# Altium schematic sheet Main.SchDoc
size A4; SheetNumber: 1; SheetTotal: 1
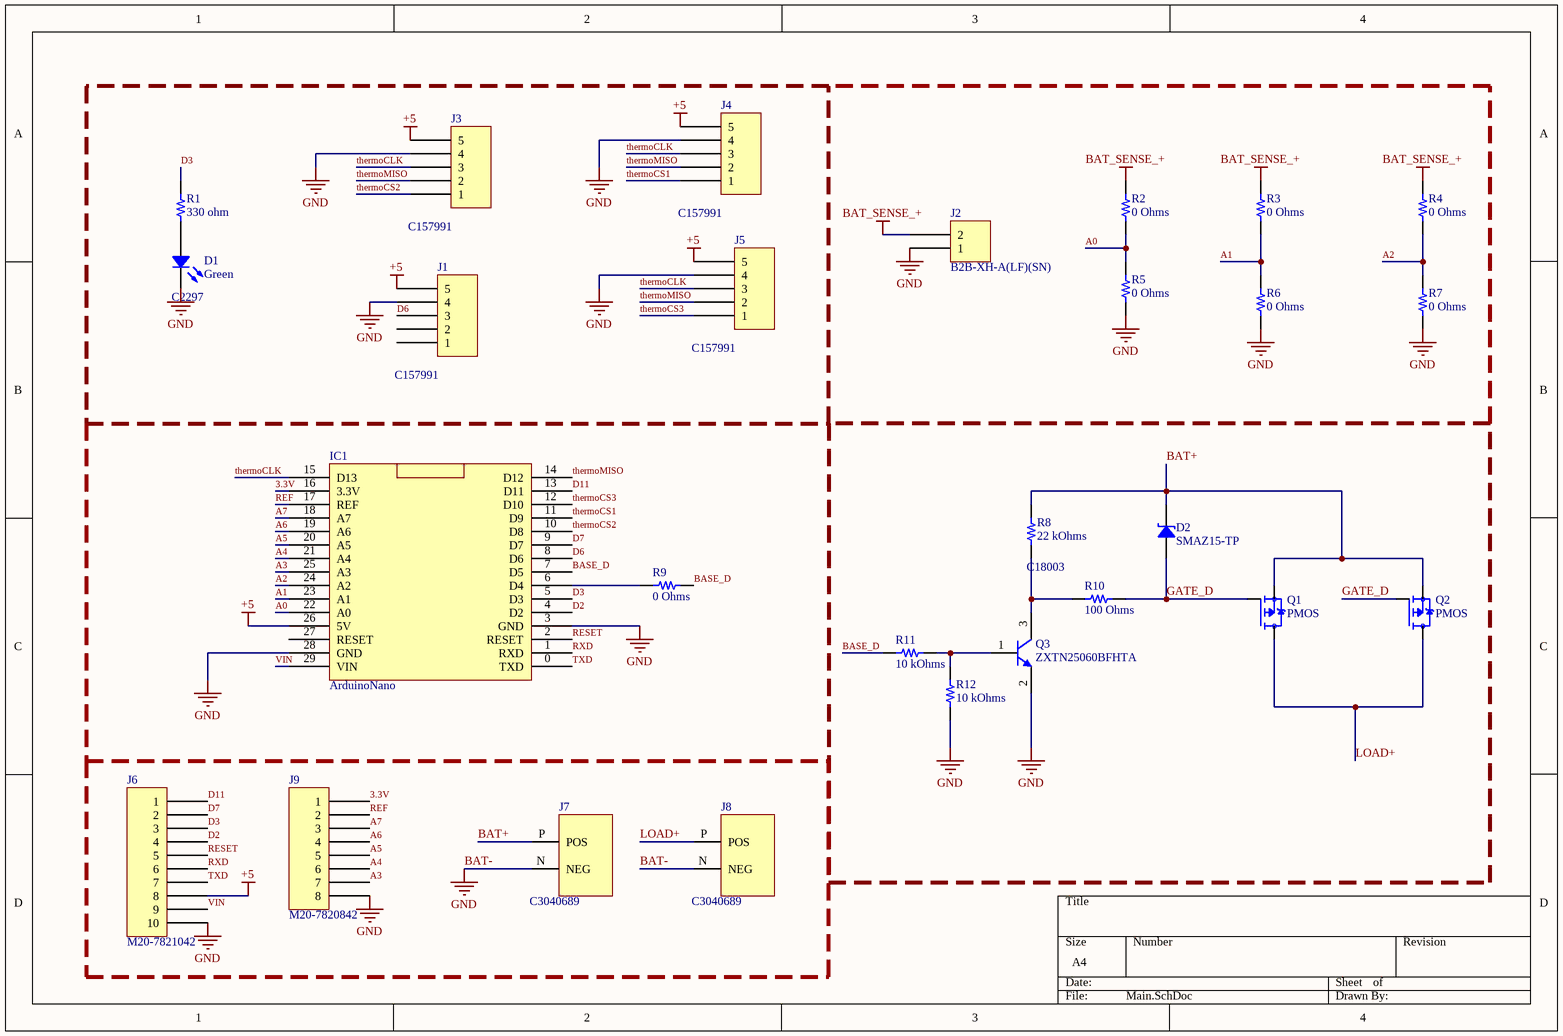
[diagram p0: Main.SchDoc]

## Parts
D1  Green  JLCPCB Part Number: C2297  [LED 0805_2012 GREEN]
D2  SMAZ15-TP  [DO214AC SMA]
IC1  ArduinoNano  [ArduinoNano_3D]
J1  JLCPCB Part Number: C157991  [JST XH B5B-XH-A]  (hidden comment: B5B-XH-A(LF)(SN))
J2  B2B-XH-A(LF)(SN)  [JST XH B2B-XH-A]
J3  JLCPCB Part Number: C157991  [JST XH B5B-XH-A]  (hidden comment: B5B-XH-A(LF)(SN))
J4  JLCPCB Part Number: C157991  [JST XH B5B-XH-A]  (hidden comment: B5B-XH-A(LF)(SN))
J5  JLCPCB Part Number: C157991  [JST XH B5B-XH-A]  (hidden comment: B5B-XH-A(LF)(SN))
J6  M20-7821042  [HARWIN M20-7821045]
J7  JLCPCB Part Number: C3040689  [XT90_PW-M]  (hidden comment: SMT XT90 CONNECTOR)
J8  JLCPCB Part Number: C3040689  [XT90_PW-M]  (hidden comment: SMT XT90 CONNECTOR)
J9  M20-7820842  [HARWIN M20-7820845]
Q1  PMOS  [TO-263-3-2]
Q2  PMOS  [TO-263-3-2]
Q3  ZXTN25060BFHTA  [DIODES SOT-23-3]
R1  330 ohm  [RES 1206_3216]
R2  0 Ohms  [RES 1206_3216]
R3  0 Ohms  [RES 1206_3216]
R4  0 Ohms  [RES 1206_3216]
R5  0 Ohms  [RES 1206_3216]
R6  0 Ohms  [RES 1206_3216]
R7  0 Ohms  [RES 1206_3216]
R8  22 kOhms  JLCPCB Part Number: C18003  [RES 1206_3216]
R9  0 Ohms  [YAGEO RES RK73 RS73 SG73 0805_2012]
R10  100 Ohms  [RES 1206_3216]
R11  10 kOhms  [RES 1206_3216]
R12  10 kOhms  [RES 1206_3216]

## Nets
+5: IC1.26(5V) J1.5 J3.5 J4.5 J5.5 J6.8
BAT-: D1.2 IC1.3(GND) IC1.28(GND) J1.4 J2.1 J3.4 J4.4 J5.4 J6.10 J7.N(NEG) J8.N(NEG) J9.8 Q3.2(E) R5.1 R6.1 R7.1 R12.1  [also labelled GND]
BAT_SENSE_+: J2.2 R2.2 R3.2 R4.2
3.3V: IC1.16(3.3V) J9.1
A0: IC1.22(A0) R2.1 R5.2
A1: IC1.23(A1) R3.1 R6.2
A2: IC1.24(A2) R4.1 R7.2
A3: IC1.25(A3) J9.7
A4: IC1.21(A4) J9.6
A5: IC1.20(A5) J9.5
A6: IC1.19(A6) J9.4
A7: IC1.18(A7) J9.3
BASE_D: IC1.7(D5) R9.1 R11.1
BAT+: D2.2 J7.P(POS) Q1.2(S) Q2.2(S) R8.2
D2: IC1.4(D2) J6.4
D3: IC1.5(D3) J6.3 R1.2
D6: IC1.8(D6) J1.3
D7: IC1.9(D7) J6.2
D11: IC1.13(D11) J6.1
GATE_D: D2.1 Q1.1(G) Q2.1(G) R10.2
LOAD+: J8.P(POS) Q1.3(D) Q2.3(D)
REF: IC1.17(REF) J9.2
RESET: IC1.2(RESET) J6.5
RXD: IC1.1(RXD) J6.6
thermoCLK: IC1.15(D13) J3.3 J4.3 J5.3
thermoCS1: IC1.11(D9) J4.1
thermoCS2: IC1.10(D8) J3.1
thermoCS3: IC1.12(D10) J5.1
thermoMISO: IC1.14(D12) J3.2 J4.2 J5.2
TXD: IC1.0(TXD) J6.7
VIN: IC1.29(VIN) J6.9
NetD1_1: D1.1 R1.1
NetIC1_6: IC1.6(D4) R9.2
NetQ3_1: Q3.1(B) R11.2 R12.2
NetQ3_3: Q3.3(C) R8.1 R10.1

Not connected (* = marked no-connect by the designer): IC1 27(RESET); J1 1 2

## Library data of the parts
D1 = 597-5311-407NF: LED GREEN DIFFUSED 0805 SMD; Manufacturer: Dialight; Current - Test: 20mA; Lens Color: White; Lens Size: 1.30mm x 1.25mm; Lens Style: Rectangle with Flat Top; Millicandela Rating: 16mcd; Viewing Angle: 140°; Voltage - Forward (Vf) (Typ): 2.15V; Wavelength - Dominant: 562nm; Part Number: 597-5311-407NF; Color: Green; ComponentLink1Description: Datasheet; ComponentLink1URL: https://s3-us-west-2.amazonaws.com/catsy.557/C18701.pdf; ComponentLink2Description: DigiKey Link; ComponentLink2URL: https://www.digikey.com/en/products/detail/dialight/597-5311-407NF/21710538; Device Package: 0805 (2012 Metric); Height (Max): 0.93mm; LastUpdated: 3.06.2024 20:00:23; Lens Transparency: Diffused; Lifecycle Status: Active; Minimum Order: 1; Mounting Type: Surface Mount; Package / Case: 0805 (2012 Metric); Packaging: TapeAndReel; PartId: 1475; Price: 0.08; Series: 597; Size / Dimension: 2.00mm L x 1.25mm W; Supplier 1: DigiKey; Supplier Part Number 1: 350-597-5311-407NFCT-ND; Supplier Device Package: 0805; Value: Green
D2 = SMAZ15-TP: DIODE ZENER 15V 1W DO214AC; Manufacturer: Micro Commercial Co; Current - Reverse Leakage @ Vr: 1 µA @ 11.4 V; Impedance (Max) (Zzt): 10 Ohms; Tolerance: ±5%; Voltage - Forward (Vf) (Max) @ If: 1.2 V @ 200 mA; Part Number: SMAZ15-TP; ComponentLink1Description: Datasheet; ComponentLink1URL: https://www.mccsemi.com/pdf/Products/SMAZ5V1%20-%20SMAZ39(DO-214AC).pdf; ComponentLink2Description: DigiKey Link; ComponentLink2URL: https://www.digikey.com/en/products/detail/micro-commercial-co/SMAZ15-TP/1793256; LastUpdated: 3.06.2024 19:55:30; Lifecycle Status: Active; Minimum Order: 1; Mounting Type: Surface Mount; Operating Temperature: -65°C ~ 150°C; Package / Case: DO-214AC, SMA; Packaging: TapeAndReel; PartId: 1156; Part Status: Active; Power - Max: 1 W; Price: 0.05; Series: -; Supplier 1: DigiKey; Supplier Part Number 1: SMAZ15-TPMSCT-ND; Supplier Device Package: DO-214AC (SMAJ); Voltage - Zener (Nom) (Vz): 15 V; JLCPCB Part Number: C110524
IC1 = ArduinoNano: ArduinoNano 3D
J1 J3-J5 = B5B-XH-A(LF)(SN): CONN HEADER VERT 5POS 2.5MM; Manufacturer: JST Sales America Inc.; Contact Length - Post: 0.134" (3.40mm); Current Rating (Amps): 3A; Material Flammability Rating: UL94 V-0; Number of Positions: 5; Number of Positions Loaded: All; Pitch - Mating: 0.098" (2.50mm); Shrouding: Shrouded - 4 Wall; Style: Board to Cable/Wire; Voltage Rating: 250V; Part Number: B5B-XH-A(LF)(SN); ComponentLink1Description: Datasheet; ComponentLink1URL: http://www.jst-mfg.com/product/pdf/eng/eXH.pdf; ComponentLink2Description: DigiKey Link; ComponentLink2URL: http://digikey.com/product-detail/en/jst-sales-america-inc/B5B-XH-A-LF-SN/455-2270-ND/1530483; Connector Type: Header; Contact Finish - Mating: Tin; Contact Finish - Post: Tin; Contact Material: Brass; Contact Shape: Square; Contact Type: Male Pin; Fastening Type: Detent Lock; Insulation Color: Natural; Insulation Height: 0.276" (7.00mm); Insulation Material: Polyamide (PA66), Nylon 6/6; LastUpdated: 12.01.2020 23:46:46; Lifecycle Status: Active; Minimum Order: 1; Mounting Type: Through Hole; Number of Rows: 1; Operating Temperature: -25°C ~ 85°C; Packaging: Bulk; PartId: 70; Part Status: Active; Price: 0.25; Series: XH; Supplier 1: DigiKey; Supplier Part Number 1: 455-2270-ND; Termination: Press-Fit, Solder
J2 = B2B-XH-A(LF)(SN): CONN HEADER VERT 2POS 2.5MM; Manufacturer: JST Sales America Inc.; Contact Length - Post: 0.134" (3.40mm); Current Rating (Amps): 3A; Material Flammability Rating: UL94 V-0; Number of Positions: 2; Number of Positions Loaded: All; Pitch - Mating: 0.098" (2.50mm); Shrouding: Shrouded - 4 Wall; Style: Board to Cable/Wire; Voltage Rating: 250V; Part Number: B2B-XH-A(LF)(SN); ComponentLink1Description: Datasheet; ComponentLink1URL: http://www.jst-mfg.com/product/pdf/eng/eXH.pdf; ComponentLink2Description: DigiKey Link; ComponentLink2URL: http://digikey.com/product-detail/en/jst-sales-america-inc/B2B-XH-A-LF-SN/455-2247-ND/1651045; Connector Type: Header; Contact Finish - Mating: Tin; Contact Finish - Post: Tin; Contact Material: Brass; Contact Shape: Square; Contact Type: Male Pin; Fastening Type: Detent Lock; Insulation Color: Natural; Insulation Height: 0.276" (7.00mm); Insulation Material: Polyamide (PA66), Nylon 6/6; LastUpdated: 12.01.2020 23:46:08; Lifecycle Status: Active; Minimum Order: 1; Mounting Type: Through Hole; Number of Rows: 1; Operating Temperature: -25°C ~ 85°C; Packaging: Bulk; PartId: 67; Part Status: Active; Price: 0.15; Series: XH; Supplier 1: DigiKey; Supplier Part Number 1: 455-2247-ND; Termination: Press-Fit, Solder; JLCPCB Part Number: C2908600
J6 = M20-7821042: CONN RCPT 10POS 0.1 GOLD PCB; Manufacturer: Harwin Inc.; Connector Type: Receptacle; Contact Length - Post: 0.118" (3.00mm); Current Rating (Amps): 3A; Mated Stacking Heights: 11.04mm, 12.63mm; Material Flammability Rating: UL94 V-0; Number of Positions: 10; Number of Positions Loaded: All; Pitch - Mating: 0.100" (2.54mm); Style: Board to Board or Cable; Part Number: M20-7821042; ComponentLink1Description: Datasheet; ComponentLink1URL: https://cdn.harwin.com/pdfs/Harwin_PC_Connectors_M20.pdf; ComponentLink2Description: DigiKey Link; ComponentLink2URL: http://digikey.com/product-detail/en/harwin-inc/M20-7821042/952-1846-ND/3727813; Contact Finish - Mating: Gold; Contact Finish - Post: Tin; Contact Finish Thickness - Mating: Flash; Contact Type: Female Socket; Fastening Type: Push-Pull; Insulation Color: Black; Insulation Height: 0.335" (8.51mm); LastUpdated: 21.09.2022 18:59:03; Lifecycle Status: Active; Minimum Order: 1; Mounting Type: Through Hole; Number of Rows: 1; Operating Temperature: -40°C ~ 105°C; Packaging: Tube; Part Status: Active; Price: 1.39; Series: M20; Supplier 1: DigiKey; Supplier Part Number 1: 952-1846-ND; Termination: Solder
J7 J8 = XT90_PW-M
J9 = M20-7820842: CONN RCPT 8POS 0.1 GOLD PCB; Manufacturer: Harwin Inc.; Connector Type: Receptacle; Contact Length - Post: 0.118" (3.00mm); Current Rating (Amps): 3A; Mated Stacking Heights: 11.04mm, 12.63mm; Material Flammability Rating: UL94 V-0; Number of Positions: 8; Number of Positions Loaded: All; Pitch - Mating: 0.100" (2.54mm); Style: Board to Board or Cable; Part Number: M20-7820842; ComponentLink1Description: Datasheet; ComponentLink1URL: https://cdn.harwin.com/pdfs/C001XX_M20_Series_Connectors.pdf; ComponentLink2Description: DigiKey Link; ComponentLink2URL: https://www.digikey.com/en/products/detail/harwin-inc/M20-7820842/3727790; Contact Finish - Mating: Gold; Contact Finish - Post: Tin; Contact Finish Thickness - Mating: Flash; Contact Type: Female Socket; Fastening Type: Push-Pull; Insulation Color: Black; Insulation Height: 0.335" (8.51mm); LastUpdated: 21.09.2022 18:58:33; Lifecycle Status: Active; Minimum Order: 1; Mounting Type: Through Hole; Number of Rows: 1; Operating Temperature: -40°C ~ 105°C; Packaging: Tube; Part Status: Active; Price: 0.62; Series: M20; Supplier 1: DigiKey; Supplier Part Number 1: 952-1823-ND; Termination: Solder
Q3 = ZXTN25060BFHTA: TRANS NPN 60V 3.5A SOT23-3; Manufacturer: Diodes Incorporated; Current - Collector Cutoff (Max): 50nA (ICBO); DC Current Gain (hFE) (Min) @ Ic, Vce: 100 @ 10mA, 2V; Frequency - Transition: 185MHz; Power - Max: 1.25 W; Vce Saturation (Max) @ Ib, Ic: 175mV @ 350mA, 3.5A; Part Number: ZXTN25060BFHTA; ComponentLink1Description: Datasheet; ComponentLink1URL: https://www.diodes.com/assets/Datasheets/ZXTN25060BFH.pdf; ComponentLink2Description: DigiKey Link; ComponentLink2URL: https://www.digikey.com/en/products/detail/diodes-incorporated/ZXTN25060BFHTA/1043597; Current - Collector (Ic) (Max): 3.5 A; LastUpdated: 3.06.2024 20:24:10; Lifecycle Status: Active; Minimum Order: 1; Mounting Type: Surface Mount; Operating Temperature: -55°C ~ 150°C (TJ); Package / Case: TO-236-3, SC-59, SOT-23-3; Packaging: TapeAndReel; PartId: 49; Part Status: Active; Price: 0.19; Series: -; Supplier 1: DigiKey; Supplier Part Number 1: ZXTN25060BFHCT-ND; Supplier Device Package: SOT-23-3; Transistor Type: NPN; Voltage - Collector Emitter Breakdown (Max): 60 V; JLCPCB Part Number: C2145
R1 = CRG1206ZR: RES SMD 0 OHM JUMPER 1/4W 1206; Manufacturer: TE Connectivity Passive Product; Power (Watts): 0.25W, 1/4W; Resistance: 0 Ohms; Value: 0 Ohms; Part Number: CRG1206ZR; ComponentLink1Description: Datasheet; ComponentLink1URL: https://www.te.com/commerce/DocumentDelivery/DDEController?Action=srchrtrv&DocNm=1773204&DocType=DS&DocLang=English; ComponentLink2Description: DigiKey Link; ComponentLink2URL: https://www.digikey.com/en/products/detail/te-connectivity-passive-product/CRG1206ZR/2055692; Composition: Thick Film; Device Package: 1206 (3216 Metric); Height - Seated (Max): 0.026" (0.65mm); LastUpdated: 9.02.2024 20:54:45; Lifecycle Status: Active; Minimum Order: 1; Number of Terminations: 2; Operating Temperature: -55°C ~ 155°C; Package / Case: 1206 (3216 Metric); Packaging: TapeAndReel; PartId: 26975; Part Status: Active; Price: 0.01; Series: CRG, Neohm; Size / Dimension: 0.122" L x 0.061" W (3.10mm x 1.55mm); Supplier 1: DigiKey; Supplier Part Number 1: A106079CT-ND; Supplier Device Package: 1206; Tolerance: Jumper
R2-R7 = CRG1206ZR: RES SMD 0 OHM JUMPER 1/4W 1206; Manufacturer: TE Connectivity Passive Product; Power (Watts): 0.25W, 1/4W; Part Number: CRG1206ZR; ComponentLink1Description: Datasheet; ComponentLink1URL: https://www.te.com/commerce/DocumentDelivery/DDEController?Action=srchrtrv&DocNm=1773204&DocType=DS&DocLang=English; ComponentLink2Description: DigiKey Link; ComponentLink2URL: https://www.digikey.com/en/products/detail/te-connectivity-passive-product/CRG1206ZR/2055692; Composition: Thick Film; Device Package: 1206 (3216 Metric); Height - Seated (Max): 0.026" (0.65mm); LastUpdated: 9.02.2024 20:54:45; Lifecycle Status: Active; Minimum Order: 1; Number of Terminations: 2; Operating Temperature: -55°C ~ 155°C; Package / Case: 1206 (3216 Metric); Packaging: TapeAndReel; PartId: 26975; Part Status: Active; Price: 0.01; Resistance: 0 Ohms; Series: CRG, Neohm; Size / Dimension: 0.122" L x 0.061" W (3.10mm x 1.55mm); Supplier 1: DigiKey; Supplier Part Number 1: A106079CT-ND; Supplier Device Package: 1206; Tolerance: Jumper; Value: 0 Ohms
  R2: JLCPCB Part Number: C17900
  R5: JLCPCB Part Number: C17902
R8 = ERA-8ARB223V: RES SMD 22K OHM 0.1% 1/4W 1206; Manufacturer: Panasonic Electronic Components; Power (Watts): 0.25W, 1/4W; Temperature Coefficient: ±10ppm/°C; Part Number: ERA-8ARB223V; ComponentLink1Description: Datasheet; ComponentLink1URL: https://industrial.panasonic.com/cdbs/www-data/pdf/RDM0000/AOA0000C307.pdf; ComponentLink2Description: DigiKey Link; ComponentLink2URL: https://www.digikey.com/en/products/detail/panasonic-electronic-components/ERA-8ARB223V/5141094; Composition: Thin Film; Device Package: 1206 (3216 Metric); Features: Automotive AEC-Q200; Height - Seated (Max): 0.028" (0.70mm); LastUpdated: 9.02.2024 20:53:41; Lifecycle Status: Active; Minimum Order: 1; Number of Terminations: 2; Operating Temperature: -55°C ~ 155°C; Package / Case: 1206 (3216 Metric); Packaging: TapeAndReel; PartId: 43618; Part Status: Active; Price: 0.37; Ratings: AEC-Q200; Resistance: 22 kOhms; Series: ERA-8A; Size / Dimension: 0.126" L x 0.063" W (3.20mm x 1.60mm); Supplier 1: DigiKey; Supplier Part Number 1: P22KCSCT-ND; Supplier Device Package: 1206; Tolerance: ±0.1%; Value: 22 kOhms
R9 = RK73Z2ATTED: RESISTOR; Manufacturer: KOA Speer Electronics, Inc.; Tolerance: Jumper; Part Number: RK73Z2ATTED; Value: 0 Ohms; ComponentLink1Description: Datasheet; ComponentLink1URL: https://www.koaspeer.com/pdfs/RK73Z.pdf; ComponentLink2Description: DigiKey Link; ComponentLink2URL: https://www.digikey.com/en/products/detail/koa-speer-electronics-inc/RK73Z2ATTED/21679892; Composition: Thick Film; Device Package: 0805 (2012 Metric); Features: Automotive AEC-Q200; Height - Seated (Max): 0.024" (0.60mm); LastUpdated: 25.07.2024 09:45:07; Lifecycle Status: Active; Minimum Order: 1; Number of Terminations: 2; Operating Temperature: -55°C ~ 155°C; Package / Case: 0805 (2012 Metric); Packaging: TapeAndReel; PartId: 90035; Price: 0.01; Ratings: AEC-Q200; Resistance: 0 Ohms; Series: RK73Z; Size / Dimension: 0.079" L x 0.049" W (2.00mm x 1.25mm); Supplier 1: DigiKey; Supplier Part Number 1: 2019-RK73Z2ATTEDCT-ND; Supplier Device Package: 0805
R10 = SG73P2BTTD101J: RES 100 OHM 5% 3/4W 1206; Manufacturer: KOA Speer Electronics, Inc.; Power (Watts): 0.75W, 3/4W; Temperature Coefficient: ±200ppm/°C; Part Number: SG73P2BTTD101J; ComponentLink1Description: Datasheet; ComponentLink1URL: https://www.koaspeer.com/pdfs/SG73P.pdf; ComponentLink2Description: DigiKey Link; ComponentLink2URL: https://www.digikey.com/en/products/detail/koa-speer-electronics-inc/SG73P2BTTD101J/10192996; Composition: Thick Film; Device Package: 1206 (3216 Metric); Features: Automotive AEC-Q200, Pulse Withstanding; Height - Seated (Max): 0.028" (0.70mm); LastUpdated: 9.02.2024 20:53:01; Lifecycle Status: Active; Minimum Order: 1; Number of Terminations: 2; Operating Temperature: -55°C ~ 155°C; Package / Case: 1206 (3216 Metric); Packaging: TapeAndReel; PartId: 72283; Part Status: Active; Price: 0.02; Ratings: AEC-Q200; Resistance: 100 Ohms; Series: SG73P; Size / Dimension: 0.126" L x 0.063" W (3.20mm x 1.60mm); Supplier 1: DigiKey; Supplier Part Number 1: 2019-SG73P2BTTD101JCT-ND; Supplier Device Package: 1206; Tolerance: ±5%; Value: 100 Ohms; JLCPCB Part Number: C17901
R11 R12 = RN73H2BTTD1002B10: RES 10K OHM 0.1% 1/4W 1206; Manufacturer: KOA Speer Electronics, Inc.; Power (Watts): 0.25W, 1/4W; Temperature Coefficient: ±10ppm/°C; Part Number: RN73H2BTTD1002B10; ComponentLink1Description: Datasheet; ComponentLink1URL: http://www.koaspeer.com/catimages/Products/RN73H/RN73H.pdf; ComponentLink2Description: DigiKey Link; ComponentLink2URL: https://www.digikey.com/en/products/detail/koa-speer-electronics-inc/RN73H2BTTD1002B10/10064203; Composition: Metal Film; Device Package: 1206 (3216 Metric); Features: Automotive AEC-Q200, Moisture Resistant; Height - Seated (Max): 0.028" (0.70mm); LastUpdated: 9.02.2024 20:53:56; Lifecycle Status: Active; Minimum Order: 1; Number of Terminations: 2; Operating Temperature: -55°C ~ 155°C; Package / Case: 1206 (3216 Metric); Packaging: TapeAndReel; PartId: 40038; Part Status: Active; Price: 0.33; Ratings: AEC-Q200; Resistance: 10 kOhms; Series: RN73H; Size / Dimension: 0.126" L x 0.063" W (3.20mm x 1.60mm); Supplier 1: DigiKey; Supplier Part Number 1: 2019-RN73H2BTTD1002B10CT-ND; Supplier Device Package: 1206; Tolerance: ±0.1%; Value: 10 kOhms; JLCPCB Part Number: C17902
Q1 Q2 = PMOS: JLCPCB Part Number: C2909634